# Altium schematic sheet main_chip.SchDoc
size A3; SheetNumber: 2; SheetTotal: 4
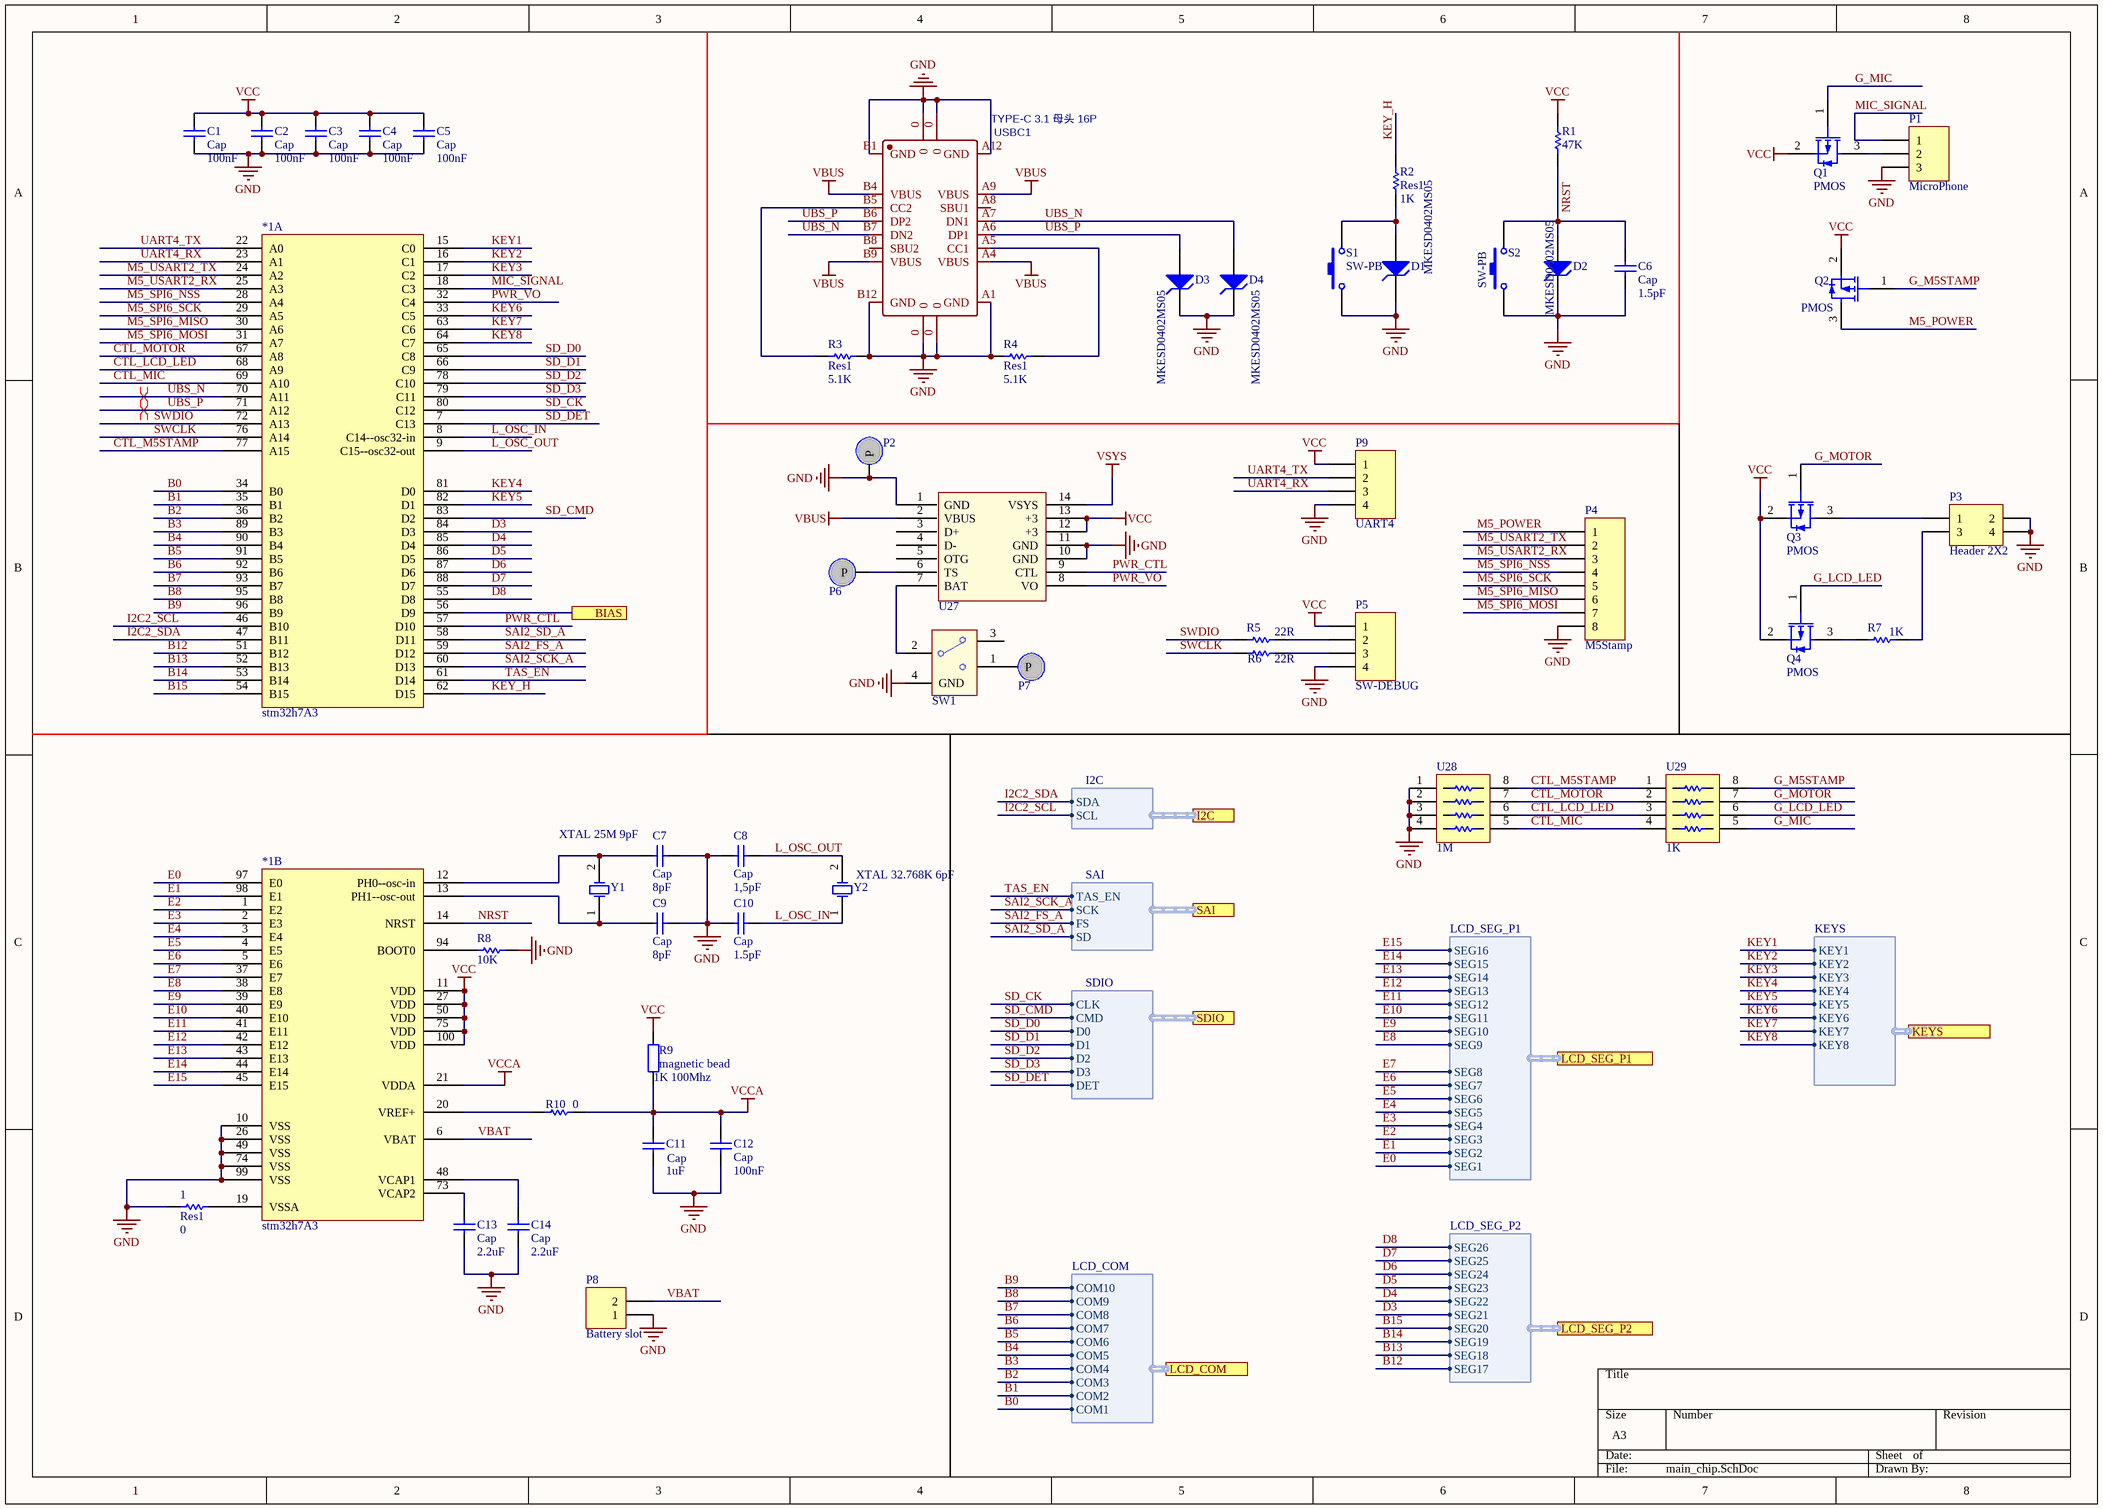
[diagram p0: main_chip.SchDoc]

## Parts
1  Res1  value 0  [0402]
*1  stm32h7A3  [CQFP-100]  (parts A,B of 2)
C1  Cap  value 100nF  [0402]
C2  Cap  value 100nF  [0402]
C3  Cap  value 100nF  [0402]
C4  Cap  value 100nF  [0402]
C5  Cap  value 100nF  [0402]
C6  Cap  value 1.5pF  [0402]
C7  Cap  value 8pF  [0402]
C8  Cap  value 1,5pF  [0402]
C9  Cap  value 8pF  [0402]
C10  Cap  value 1.5pF  [0402]
C11  Cap  value 1uF  [6-0805_L]
C12  Cap  value 100nF  [0402]
C13  Cap  value 2.2uF  [6-0805_L]
C14  Cap  value 2.2uF  [6-0805_L]
D1  MKESD0402MS05  [0402]
D2  MKESD0402MS05  [0402]
D3  MKESD0402MS05  [0402]
D4  MKESD0402MS05  [0402]
P1  MicroPhone  [HDR1X3]
P2  Point  [Point]  (value not drawn)
P3  Header 2X2  [HDR2X2]
P4  M5Stamp  [HDR1X8]
P5  SW-DEBUG  [HDR1X4]
P6  Point  [Point]  (value not drawn)
P7  Point  [Point]  (value not drawn)
P8  Battery slot  [CR1220-SLOT]
P9  UART4  [HDR1X4]
Q1  PMOS  [SOT23-3]
Q2  PMOS  [SOT23-3]
Q3  PMOS  [SOT23-3]
Q4  PMOS  [SOT23-3]
R1  value 47K  [0402]  (hidden comment: Res1)
R2  Res1  value 1K  [0402]
R3  Res1  value 5.1K  [0402]
R4  Res1  value 5.1K  [0402]
R5  value 22R  [0402]  (hidden comment: Res1)
R6  value 22R  [0402]  (hidden comment: Res1)
R7  value 1K  [0402]  (hidden comment: Res1)
R8  value 10K  [0402]  (hidden comment: Res1)
R9  magnetic bead  value 1K 100Mhz  [0402]
R10  value 0  [0402]  (hidden comment: Res1)
S1  SW-PB  [BTN_0304]
S2  SW-PB  [BTN_0304]
SW1  SK-12D07VG3  [switch]  (value not drawn)
U27  my_power  [my_power]  (value not drawn)
U28  1M  [0603_RES_BATCH]
U29  1K  [0603_RES_BATCH]
USBC1  TYPE-C 3.1 母头 16P  [USB-C-SMD_16P]
Y1  XTAL 25M 9pF  [xtal_5032_25Mhz]
Y2  XTAL 32.768K 6pF  [xtal_3215_32768]

## Ports
BIAS, I2C (harness I2C), KEYS (harness KEYS), LCD_COM (harness LCD_COM), LCD_SEG_P1 (harness LCD_SEG_P1), LCD_SEG_P2 (harness LCD_SEG_P2), SAI (harness SAI), SDIO (harness SDIO)

## Harnesses
I2C: SDA, SCL
SAI: TAS_EN, SCK, FS, SD
SDIO: CLK, CMD, D0, D1, D2, D3, DET
LCD_COM: COM10, COM9, COM8, COM7, COM6, COM5, COM4, COM3, COM2, COM1
LCD_SEG_P1: SEG8, SEG7, SEG6, SEG5, SEG4, SEG3, SEG2, SEG1, SEG9, SEG16, SEG15, SEG14, SEG13, SEG12, SEG11, SEG10
LCD_SEG_P2: SEG21, SEG20, SEG19, SEG18, SEG17, SEG26, SEG25, SEG24, SEG23, SEG22
KEYS: KEY1, KEY2, KEY3, KEY4, KEY5, KEY6, KEY7, KEY8

## Nets
GND: 1.1 *1.10(VSS) *1.26(VSS) *1.49(VSS) *1.74(VSS) *1.99(VSS) C1.2 C2.2 C3.2 C4.2 C5.2 C6.2 C7.1 C8.2 C9.1 C10.2 C11.1 C12.1 C13.1 C14.2 D1.2(K) D2.2(K) D3.2(K) D4.2(K) P1.3 P2.1(P) P3.2 P3.4 P4.8 P5.4 P8.1 P9.4 R3.1 R4.2 R8.1 S1.1 S2.1 SW1.4(GND) U27.1(GND) U27.10(GND) U27.11(GND) U28.1 U28.2 U28.3 U28.4 USBC1.0 USBC1.A1(GND) USBC1.A12(GND) USBC1.B1(GND) USBC1.B12(GND)
VBUS: U27.2(VBUS) USBC1.A4(VBUS) USBC1.A9(VBUS) USBC1.B4(VBUS) USBC1.B9(VBUS)
VCC: *1.11(VDD) *1.27(VDD) *1.50(VDD) *1.75(VDD) *1.100(VDD) C1.1 C2.1 C3.1 C4.1 C5.1 P5.1 P9.1 Q1.2(S) Q2.2(S) Q3.2(S) Q4.2(S) R1.1 R9.2 U27.12(+3) U27.13(+3)
VCCA: *1.21(VDDA) C11.2 C12.2 R9.1 R10.1
VSYS: U27.14(VSYS)
B0: *1.34(B0) ; port LCD_COM.COM1
B1: *1.35(B1) ; port LCD_COM.COM2
B2: *1.36(B2) ; port LCD_COM.COM3
B3: *1.89(B3) ; port LCD_COM.COM4
B4: *1.90(B4) ; port LCD_COM.COM5
B5: *1.91(B5) ; port LCD_COM.COM6
B6: *1.92(B6) ; port LCD_COM.COM7
B7: *1.93(B7) ; port LCD_COM.COM8
B8: *1.95(B8) ; port LCD_COM.COM9
B9: *1.96(B9) ; port LCD_COM.COM10
B12: *1.51(B12) ; port LCD_SEG_P2.SEG17
B13: *1.52(B13) ; port LCD_SEG_P2.SEG18
B14: *1.53(B14) ; port LCD_SEG_P2.SEG19
B15: *1.54(B15) ; port LCD_SEG_P2.SEG20
BIAS: *1.56(D9) ; port BIAS
CTL_LCD_LED: *1.68(A9) U28.6 U29.3
CTL_M5STAMP: *1.77(A15) U28.8 U29.1
CTL_MIC: *1.69(A10) U28.5 U29.4
CTL_MOTOR: *1.67(A8) U28.7 U29.2
D3: *1.84(D3) ; port LCD_SEG_P2.SEG21
D4: *1.85(D4) ; port LCD_SEG_P2.SEG22
D5: *1.86(D5) ; port LCD_SEG_P2.SEG23
D6: *1.87(D6) ; port LCD_SEG_P2.SEG24
D7: *1.88(D7) ; port LCD_SEG_P2.SEG25
D8: *1.55(D8) ; port LCD_SEG_P2.SEG26
E0: *1.97(E0) ; port LCD_SEG_P1.SEG1
E1: *1.98(E1) ; port LCD_SEG_P1.SEG2
E2: *1.1(E2) ; port LCD_SEG_P1.SEG3
E3: *1.2(E3) ; port LCD_SEG_P1.SEG4
E4: *1.3(E4) ; port LCD_SEG_P1.SEG5
E5: *1.4(E5) ; port LCD_SEG_P1.SEG6
E6: *1.5(E6) ; port LCD_SEG_P1.SEG7
E7: *1.37(E7) ; port LCD_SEG_P1.SEG8
E8: *1.38(E8) ; port LCD_SEG_P1.SEG9
E9: *1.39(E9) ; port LCD_SEG_P1.SEG10
E10: *1.40(E10) ; port LCD_SEG_P1.SEG11
E11: *1.41(E11) ; port LCD_SEG_P1.SEG12
E12: *1.42(E12) ; port LCD_SEG_P1.SEG13
E13: *1.43(E13) ; port LCD_SEG_P1.SEG14
E14: *1.44(E14) ; port LCD_SEG_P1.SEG15
E15: *1.45(E15) ; port LCD_SEG_P1.SEG16
G_LCD_LED: Q4.1(G) U29.6
G_M5STAMP: Q2.1(G) U29.8
G_MIC: Q1.1(G) U29.5
G_MOTOR: Q3.1(G) U29.7
I2C2_SCL: *1.46(B10) ; port I2C.SCL
I2C2_SDA: *1.47(B11) ; port I2C.SDA
KEY1: *1.15(C0) ; port KEYS.KEY1
KEY2: *1.16(C1) ; port KEYS.KEY2
KEY3: *1.17(C2) ; port KEYS.KEY3
KEY4: *1.81(D0) ; port KEYS.KEY4
KEY5: *1.82(D1) ; port KEYS.KEY5
KEY6: *1.33(C5) ; port KEYS.KEY6
KEY7: *1.63(C6) ; port KEYS.KEY7
KEY8: *1.64(C7) ; port KEYS.KEY8
KEY_H: *1.62(D15) R2.1
L_OSC_IN: *1.8(C14--osc32-in) C10.1 Y2.1(OSC1)
L_OSC_OUT: *1.9(C15--osc32-out) C8.1 Y2.2(OSC2)
M5_POWER: P4.1 Q2.3(D)
M5_SPI6_MISO: *1.30(A6) P4.6
M5_SPI6_MOSI: *1.31(A7) P4.7
M5_SPI6_NSS: *1.28(A4) P4.4
M5_SPI6_SCK: *1.29(A5) P4.5
M5_USART2_RX: *1.25(A3) P4.3
M5_USART2_TX: *1.24(A2) P4.2
MIC_SIGNAL: *1.18(C3) P1.1
NRST: *1.14(NRST) C6.1 D2.1(A) R1.2 S2.2
PWR_CTL: *1.57(D10) U27.9(CTL)
PWR_VO: *1.32(C4) U27.8(VO)
SAI2_FS_A: *1.59(D12) ; port SAI.FS
SAI2_SCK_A: *1.60(D13) ; port SAI.SCK
SAI2_SD_A: *1.58(D11) ; port SAI.SD
SD_CK: *1.80(C12) ; port SDIO.CLK
SD_CMD: *1.83(D2) ; port SDIO.CMD
SD_D0: *1.65(C8) ; port SDIO.D0
SD_D1: *1.66(C9) ; port SDIO.D1
SD_D2: *1.78(C10) ; port SDIO.D2
SD_D3: *1.79(C11) ; port SDIO.D3
SD_DET: *1.7(C13) ; port SDIO.DET
SWCLK: *1.76(A14) R6.1
SWDIO: *1.72(A13) R5.1
TAS_EN: *1.61(D14) ; port SAI.TAS_EN
UART4_RX: *1.23(A1) P9.3
UART4_TX: *1.22(A0) P9.2
UBS_N: *1.70(A11) D4.1(A) USBC1.A7(DN1) USBC1.B7(DN2)
UBS_P: *1.71(A12) D3.1(A) USBC1.A6(DP1) USBC1.B6(DP2)
VBAT: *1.6(VBAT) P8.2
Net1_2: 1.2 *1.19(VSSA)
Net*1_12: *1.12(PH0--osc-in) C7.2 Y1.2(OSC2)
Net*1_13: *1.13(PH1--osc-out) C9.2 Y1.1(OSC1)
Net*1_20: *1.20(VREF+) R10.2
Net*1_48: *1.48(VCAP1) C14.1
Net*1_73: *1.73(VCAP2) C13.2
Net*1_94: *1.94(BOOT0) R8.2
NetD1_1: D1.1(A) R2.2 S1.2
NetP1_2: P1.2 Q1.3(D)
NetP3_1: P3.1 Q3.3(D)
NetP3_3: P3.3 R7.1
NetP5_2: P5.2 R5.2
NetP5_3: P5.3 R6.2
NetP6_1: P6.1(P) U27.6(TS)
NetP7_1: P7.1(P) SW1.1
NetQ4_3: Q4.3(D) R7.2
NetR3_2: R3.2 USBC1.B5(CC2)
NetR4_1: R4.1 USBC1.A5(CC1)
NetSW1_2: SW1.2 U27.7(BAT)

Not connected (* = marked no-connect by the designer): SW1 3; U27 3(D+) 4(D-) 5(OTG); USBC1 A8(SBU1) B8(SBU2)

## Layout directives
differential pair: UBS_N, UBS_P

## Library data of the parts
1 R1-R8 R10 = Res1: Resistor; Published: 8-Jun-2000; LatestRevisionDate: 17-Jul-2002; LatestRevisionNote: Re-released for DXP Platform.; PackageReference: AXIAL-0.3; Publisher: Altium Limited; PackageDescription: Axial Device, Thru-Hole; 2 Leads; 0.3 in Pin Spacing
*1 = stm32h743
C1-C14 = Cap: Capacitor; Published: 8-Jun-2000; LatestRevisionDate: 17-Jul-2002; LatestRevisionNote: Re-released for DXP Platform.; PackageReference: RAD-0.3; Publisher: Altium Limited; PackageDescription: Radial Cap, Thru-Hole; 2 Leads; 0.3 in Pin Spacing
D1-D4 = D Zener: Zener Diode; Published: 8-Jun-2000; LatestRevisionDate: 17-Jul-2002; LatestRevisionNote: Re-released for DXP Platform.; PackageReference: DIODE-0.7; Publisher: Altium Limited; PackageDescription: Diode, Thru-Hole; 2 Leads; 0.7 in Pin Spacing
P1 = Header 3: Header, 3-Pin; LatestRevisionDate: 17-Jul-2002; LatestRevisionNote: Re-released for DXP Platform.; Publisher: Altium Limited
P3 = Header 2X2: Header, 2-Pin, Dual row; LatestRevisionDate: 17-Jul-2002; LatestRevisionNote: Re-released for DXP Platform.; Publisher: Altium Limited
P4 = Header 8: Header, 8-Pin; LatestRevisionDate: 17-Jul-2002; LatestRevisionNote: Re-released for DXP Platform.; Publisher: Altium Limited
P5 P9 = Header 4: Header, 4-Pin; LatestRevisionDate: 17-Jul-2002; LatestRevisionNote: Re-released for DXP Platform.; Publisher: Altium Limited
P8 = Header 2: Header, 2-Pin; LatestRevisionDate: 17-Jul-2002; LatestRevisionNote: Re-released for DXP Platform.; Publisher: Altium Limited
R9 = Res2: Resistor; Published: 8-Jun-2000; LatestRevisionDate: 17-Jul-2002; LatestRevisionNote: Re-released for DXP Platform.; PackageReference: AXIAL-0.4; Publisher: Altium Limited; PackageDescription: Axial Device, Thru-Hole; 2 Leads; 0.4 in Pin Spacing
S1 S2 = SW-PB: Switch; Published: 24-Mar-1999; LatestRevisionDate: 17-Jul-2002; LatestRevisionNote: Re-released for DXP Platform.; PackageReference: SPST-2; Publisher: Altium Limited; PackageDescription: Switch; 2 Leads
SW1 = SW-8.6mm
U28 U29 = RES_BATCH
Y1 Y2 = XTAL: Crystal Oscillator; Published: 8-Jun-2000; LatestRevisionDate: 17-Jul-2002; LatestRevisionNote: Re-released for DXP Platform.; PackageReference: R38; Publisher: Altium Limited; PackageDescription: Crystal, Thru-Hole; 2 Leads; Body 3.1 x 8.2 mm (Dia.xH)